# Altium schematic sheet Controlador de corriente V2.SchDoc: Levitador magnético
size A4
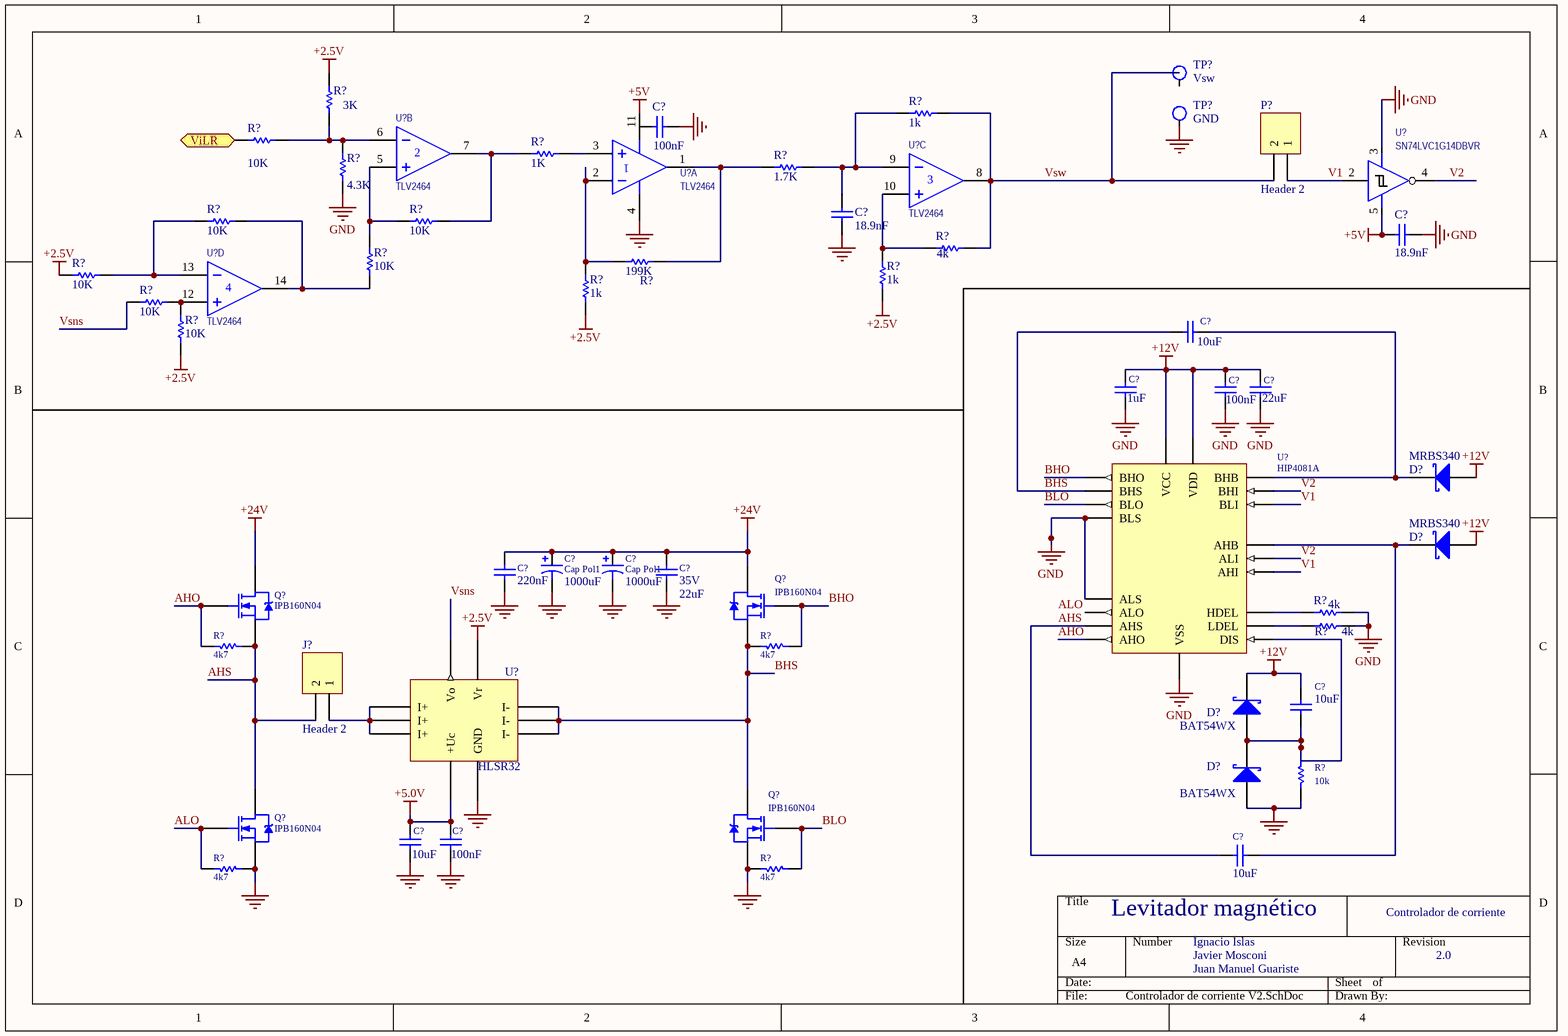
[diagram p0: Controlador de corriente V2.SchDoc]

## Parts
(Parts that share a designator on the sheet are numbered #1, #2 ... from top to bottom, then left to right.)
C?#1  value 100nF  [C1206]  (hidden comment: Cap)
C?#2  value 18.9nF  [C1206]  (hidden comment: Cap)
C?#3  value 18.9nF  [C1206]  (hidden comment: Cap)
C?#4  10uF  [C1206]
C?#5  1uF  [C1206]
C?#6  100nF  [C1206]
C?#7  22uF  [C1206]
C?#8  Cap Pol1  value 1000uF  [ALU CASE P]
C?#9  Cap Pol1  value 1000uF  [ALU CASE P]
C?#10  220nF  [C1206]
C?#11  Voltage: 35V  [C0805]  (hidden comment: 22uF)
C?#12  10uF  [C1206]
C?#13  10uF  [C1206]
C?#14  100nF  [C1206]
C?#15  10uF  [C1206]
D?#1  MRBS340  [SOD523]
D?#2  MRBS340  [SOD523]
D?#3  BAT54WX  [SOD523]
D?#4  BAT54WX  [SOD523]
J?  Header 2  [SMKDS5-2-9.5]
P?  Header 2  [HDR1X2]
Q?#1  IPB160N04  [TO263-7S]
Q?#2  IPB160N04  [TO263-7S]
Q?#3  IPB160N04  [TO263-7S]
Q?#4  IPB160N04  [TO263-7S]
R?#1  value 1k  [R1206]  (hidden comment: Res1)
R?#2  value 3K  [R1206]  (hidden comment: Res1)
R?#3  value 10K  [R1206]  (hidden comment: Res1)
R?#4  value 1K  [R1206]  (hidden comment: Res1)
R?#5  value 4.3K  [R1206]  (hidden comment: Res1)
R?#6  value 1.7K  [R1206]  (hidden comment: Res1)
R?#7  value 10K  [R1206]  (hidden comment: Res1)
R?#8  value 10K  [R1206]  (hidden comment: Res1)
R?#9  value 4k  [R1206]  (hidden comment: Res1)
R?#10  value 199K  [R1206]  (hidden comment: Res1)
R?#11  value 10K  [R1206]  (hidden comment: Res1)
R?#12  value 10K  [R1206]  (hidden comment: Res1)
R?#13  value 10K  [R1206]  (hidden comment: Res1)
R?#14  value 1k  [R1206]  (hidden comment: Res1)
R?#15  value 1k  [R1206]  (hidden comment: Res1)
R?#16  value 10K  [R1206]  (hidden comment: Res1)
R?#17  value 4k  [R1206]  (hidden comment: Res1)
R?#18  value 4k  [R1206]  (hidden comment: Res1)
R?#19  4k7  [R1206]
R?#20  4k7  [R1206]
R?#21  10k  [R1206]
R?#22  4k7  [R1206]
R?#23  4k7  [R1206]
TP?#1  Vsw  [TestPoint Keystone 5000 Silver-Red]
TP?#2  GND  [TestPoint Keystone 5000 Silver-Red]
U?#1  TLV2464  [SOIC14]  (part B of 4)
U?#2  TLV2464  [SOIC14]  (part C of 4)
U?#3  TLV2464  [SOIC14]  (part A of 4)
U?#4  SN74LVC1G14DBVR  [SOT23-5]
U?#5  TLV2464  [SOIC14]  (part D of 4)
U?#6  HIP4081A  [SOIC20]
U?#7  HLSR32  [HSLR-P]

## Ports
ViLR (in)

## Nets
+2.5V: R?#2.2 R?#11.1 R?#14.1 R?#15.1 R?#16.1 U?#7.1(Vr)
+5.0V: C?#13.2 C?#14.2 U?#7.4(+Uc)
+5V: C?#3.1 U?#3.11(V-) U?#4.5(V+)
+12V: C?#5.2 C?#6.2 C?#7.2 C?#12.1 D?#1.1(A) D?#2.1(A) D?#3.2(K) U?#6.15(VCC) U?#6.16(VDD)
+24V: C?#8.1 C?#9.1 C?#10.2 C?#11.2 Q?#1.4(D) Q?#2.4(D)
GND: C?#1.2 C?#2.1 C?#3.2 C?#5.1 C?#6.1 C?#7.1 C?#8.2 C?#9.2 C?#10.1 C?#11.1 C?#13.1 C?#14.1 D?#4.1(A) Q?#3.2(S) Q?#3.3(S) Q?#3.5(S) Q?#3.6(S) Q?#3.7(S) Q?#4.2(S) Q?#4.3(S) Q?#4.5(S) Q?#4.6(S) Q?#4.7(S) R?#5.2 R?#17.2 R?#18.2 R?#21.2 R?#22.1 R?#23.2 TP?#2.1 U?#3.4(V+) U?#4.3(V-) U?#6.4(VSS) U?#6.14(ALS) U?#6.17(BLS) U?#7.3(GND)
AHO: Q?#1.1(G) R?#19.2 U?#6.11(AHO)
AHS: C?#15.1 J?.2 Q?#1.2(S) Q?#1.3(S) Q?#1.5(S) Q?#1.6(S) Q?#1.7(S) Q?#3.4(D) R?#19.1 U?#6.12(AHS)
ALO: Q?#3.1(G) R?#22.2
BHO: Q?#2.1(G) R?#20.1 U?#6.20(BHO)
BHS: C?#4.2 Q?#2.2(S) Q?#2.3(S) Q?#2.5(S) Q?#2.6(S) Q?#2.7(S) Q?#4.4(D) R?#20.2 U?#6.19(BHS) U?#7.5(I-) U?#7.6(I-) U?#7.7(I-)
BLO: Q?#4.1(G) R?#23.1 U?#6.18(BLO)
V1: P?.1 U?#4.2(A) U?#6.5(BLI) U?#6.7(AHI)
V2: U?#4.4(Y) U?#6.2(BHI) U?#6.6(ALI)
ViLR: R?#3.1 ; port ViLR
Vsns: R?#13.1 U?#7.2(Vo)
Vsw: P?.2 R?#1.2 R?#9.2 U?#2.8(OUT)
NetC?#2_2: C?#2.2 R?#1.1 R?#6.2 U?#2.9(IN-)
NetC?#4_1: C?#4.1 D?#1.2(K) U?#6.1(BHB)
NetC?#12_2: C?#12.2 D?#3.1(A) D?#4.2(K) R?#21.1 U?#6.3(DIS)
NetC?#15_2: C?#15.2 D?#2.2(K) U?#6.10(AHB)
NetJ?_1: J?.1 U?#7.8(I+) U?#7.9(I+) U?#7.10(I+)
NetR?#2_1: R?#2.1 R?#3.2 R?#5.1 U?#1.6(IN-)
NetR?#4_1: R?#4.1 R?#8.2 U?#1.7(OUT)
NetR?#4_2: R?#4.2 U?#3.3(IN+)
NetR?#6_1: R?#6.1 R?#10.2 U?#3.1(OUT)
NetR?#7_1: R?#7.1 R?#11.2 U?#5.13(IN-)
NetR?#7_2: R?#7.2 R?#12.1 U?#5.14(OUT)
NetR?#8_1: R?#8.1 R?#12.2 U?#1.5(IN+)
NetR?#9_1: R?#9.1 R?#14.2 U?#2.10(IN+)
NetR?#10_1: R?#10.1 R?#15.2 U?#3.2(IN-)
NetR?#13_2: R?#13.2 R?#16.2 U?#5.12(IN+)
NetR?#17_1: R?#17.1 U?#6.8(HDEL)
NetR?#18_1: R?#18.1 U?#6.9(LDEL)

Not connected (* = marked no-connect by the designer): C?#1 1; TP?#1 1; U?#6 13(ALO)

## Notes on the sheet
- Controlador de corriente
- Ignacio Islas
- Javier Mosconi
- Juan Manuel Guariste
- 2.0
- Labels drawn without touching a wire or pin: ALO

## Library data of the parts
C?#1-C?#3 = Cap: Capacitor; Published: 8-Jun-2000; LatestRevisionDate: 17-Jul-2002; LatestRevisionNote: Re-released for DXP Platform.; PackageReference: RAD-0.3; Publisher: Altium Limited; PackageDescription: Radial Cap, Thru-Hole; 2 Leads; 0.3 in Pin Spacing
C?#4-C?#7 C?#10 C?#12-C?#15 = C1206: Capacitor Chip 1206; Dielectric: NP0; Voltage: 50V; Published: 8-Jun-2000; LatestRevisionDate: 26/08/2013; LatestRevisionNote: IPC-7351 Footprint Added.; PackageReference: 1206; Publisher: Altium Limited; PackageDescription: Chip Capacitor; Supplier 1: Digi-Key
  C?#4 C?#12 C?#13 C?#15: Value: 10uF
  C?#5: Value: 1uF
  C?#6 C?#14: Value: 100nF
  C?#7: Value: 22uF
  C?#10: Value: 220nF
C?#8 C?#9 = Cap Pol1: Polarized Capacitor (Radial); Published: 8-Jun-2000; LatestRevisionDate: 17-Jul-2002; LatestRevisionNote: Re-released for DXP Platform.; PackageReference: RB7.6-15; Publisher: Altium Limited
C?#11 = C1206: Capacitor Chip 1206; Dielectric: NP0; Published: 8-Jun-2000; LatestRevisionDate: 26/08/2013; LatestRevisionNote: IPC-7351 Footprint Added.; PackageReference: 1206; Publisher: Altium Limited; PackageDescription: Chip Capacitor; Supplier 1: Digi-Key; Value: 22uF
D?#1-D?#4 = Diode 10TQ035: Schottky Rectifier; Note: Terminal 2 is the TAB and is electrically connected to the cathode; Published: 8-Jun-2000; LatestRevisionDate: 17-Jul-2002; LatestRevisionNote: Re-released for DXP Platform.; DatasheetDocument: PD-2.057B; PackageDocument: Feb-1998; PackageReference: TO-220AC; Publisher: Altium Limited; ComponentLink1Description: Manufacturer Link; ComponentLink1URL: http://www.irf.com/; ComponentLink2Description: Datasheet; ComponentLink2URL: http://www.irf.com/product-info/datasheets/data/10tq.pdf
J? P? = Header 2: Header, 2-Pin; LatestRevisionDate: 17-Jul-2002; LatestRevisionNote: Re-released for DXP Platform.; Publisher: Altium Limited
Q?#1-Q?#4 = IRF630S: HEXFET N-Channel Power MOSFET; Published: 8-Jun-2000; LatestRevisionDate: 17-Jul-2002; LatestRevisionNote: Re-released for DXP Platform.; DatasheetVersion: PD-9.901; PackageReference: PG-TO263-7-3; Publisher: Altium Limited; PackageDescription: D2-PAK/TO-263-AB; 3 Leads (1 Cropped); Body 15.5 (inc. leads) x 10.5 mm (LxW max); ComponentLink1Description: Manufacturer Link; ComponentLink1URL: http://www.irf.com/; ComponentLink2Description: Datasheet; ComponentLink2URL: http://www.irf.com/product-info/datasheets/data/irf630s.pdf
R?#1-R?#18 = Res1: Resistor; Published: 8-Jun-2000; LatestRevisionDate: 17-Jul-2002; LatestRevisionNote: Re-released for DXP Platform.; PackageReference: AXIAL-0.3; Publisher: Altium Limited; PackageDescription: Axial Device, Thru-Hole; 2 Leads; 0.3 in Pin Spacing
R?#19-R?#23 = R1206: Resistor Chip; 1/8W;; Published: 8-Jun-2000; LatestRevisionDate: 26/8/2013; PackageReference: 1206; Publisher: Altium Limited; PackageDescription: SMT Chip Resistor; Supplier 1: Digi-Key
  R?#19 R?#20 R?#22 R?#23: Value: 4k7
  R?#21: Value: 10k
TP?#1 TP?#2 = Tespoint: Test point
U?#1-U?#3 U?#5 = TLV2464: Dual Low-Power Operational Amplifier; Published: 15-Apr-2002; LatestRevisionDate: 13-Apr-2006; LatestRevisionNote: IPC-7351 Footprint Added.; DatasheetVersion: Jul-1988; PackageVersion: Jan-1998; PackageReference: D008; Publisher: Altium Limited; PackageDescription: 8-Pin Small Outline Integrated Circuit 1.27 mm Pitch; Code_IPC: SOIC127P600-8; ComponentLink1Description: Manufacturer Link; ComponentLink1URL: http://www.ti.com/; ComponentLink2Description: Datasheet; ComponentLink2URL: http://www-s.ti.com/sc/ds/tl022.pdf
U?#4 = SN74LVC1G14DBVR: Schmitt-Trigger Inverter; Published: 8-Jun-2000; LatestRevisionDate: 13-Apr-2006; LatestRevisionNote: IPC-7351 Footprint Added.; DatasheetVersion: Jul-1998; PackageVersion: Jan-1998; PackageReference: D014; Publisher: Altium Limited; PackageDescription: 14-Pin Small Outline Integrated Circuit 1.27 mm Pitch; Code_IPC: SOIC127P600-14; ComponentLink1Description: Manufacturer Link; ComponentLink1URL: http://www.ti.com/; ComponentLink2Description: Datasheet; ComponentLink2URL: http://www-s.ti.com/sc/ds/sn74ahc14.pdf; ComponentLink3Description: Packaging Specification; ComponentLink3URL: http://focus.ti.com/lit/ml/mpds177/mpds177.pdf
U?#6 = HIP4081A: INTERSIL, 80V, 2.5A peak, High Frequency Full Bridge FET Driver
U?#7 = HSLR32: Hall Effect Current Sensor